# EasyEDA Pro project 十二届 蓝桥杯EDA 国赛真题.epro

# Schematic SCH
Board Name: Board1; Create Date: 2024-11-06; Page Name: SCH; Project Name: 十二届 蓝桥杯EDA 国赛真题; Schematic Name: SCH; Update Date: 2024-11-06; Company: 嘉立创EDA; Page Size: A3; Version: V1.0
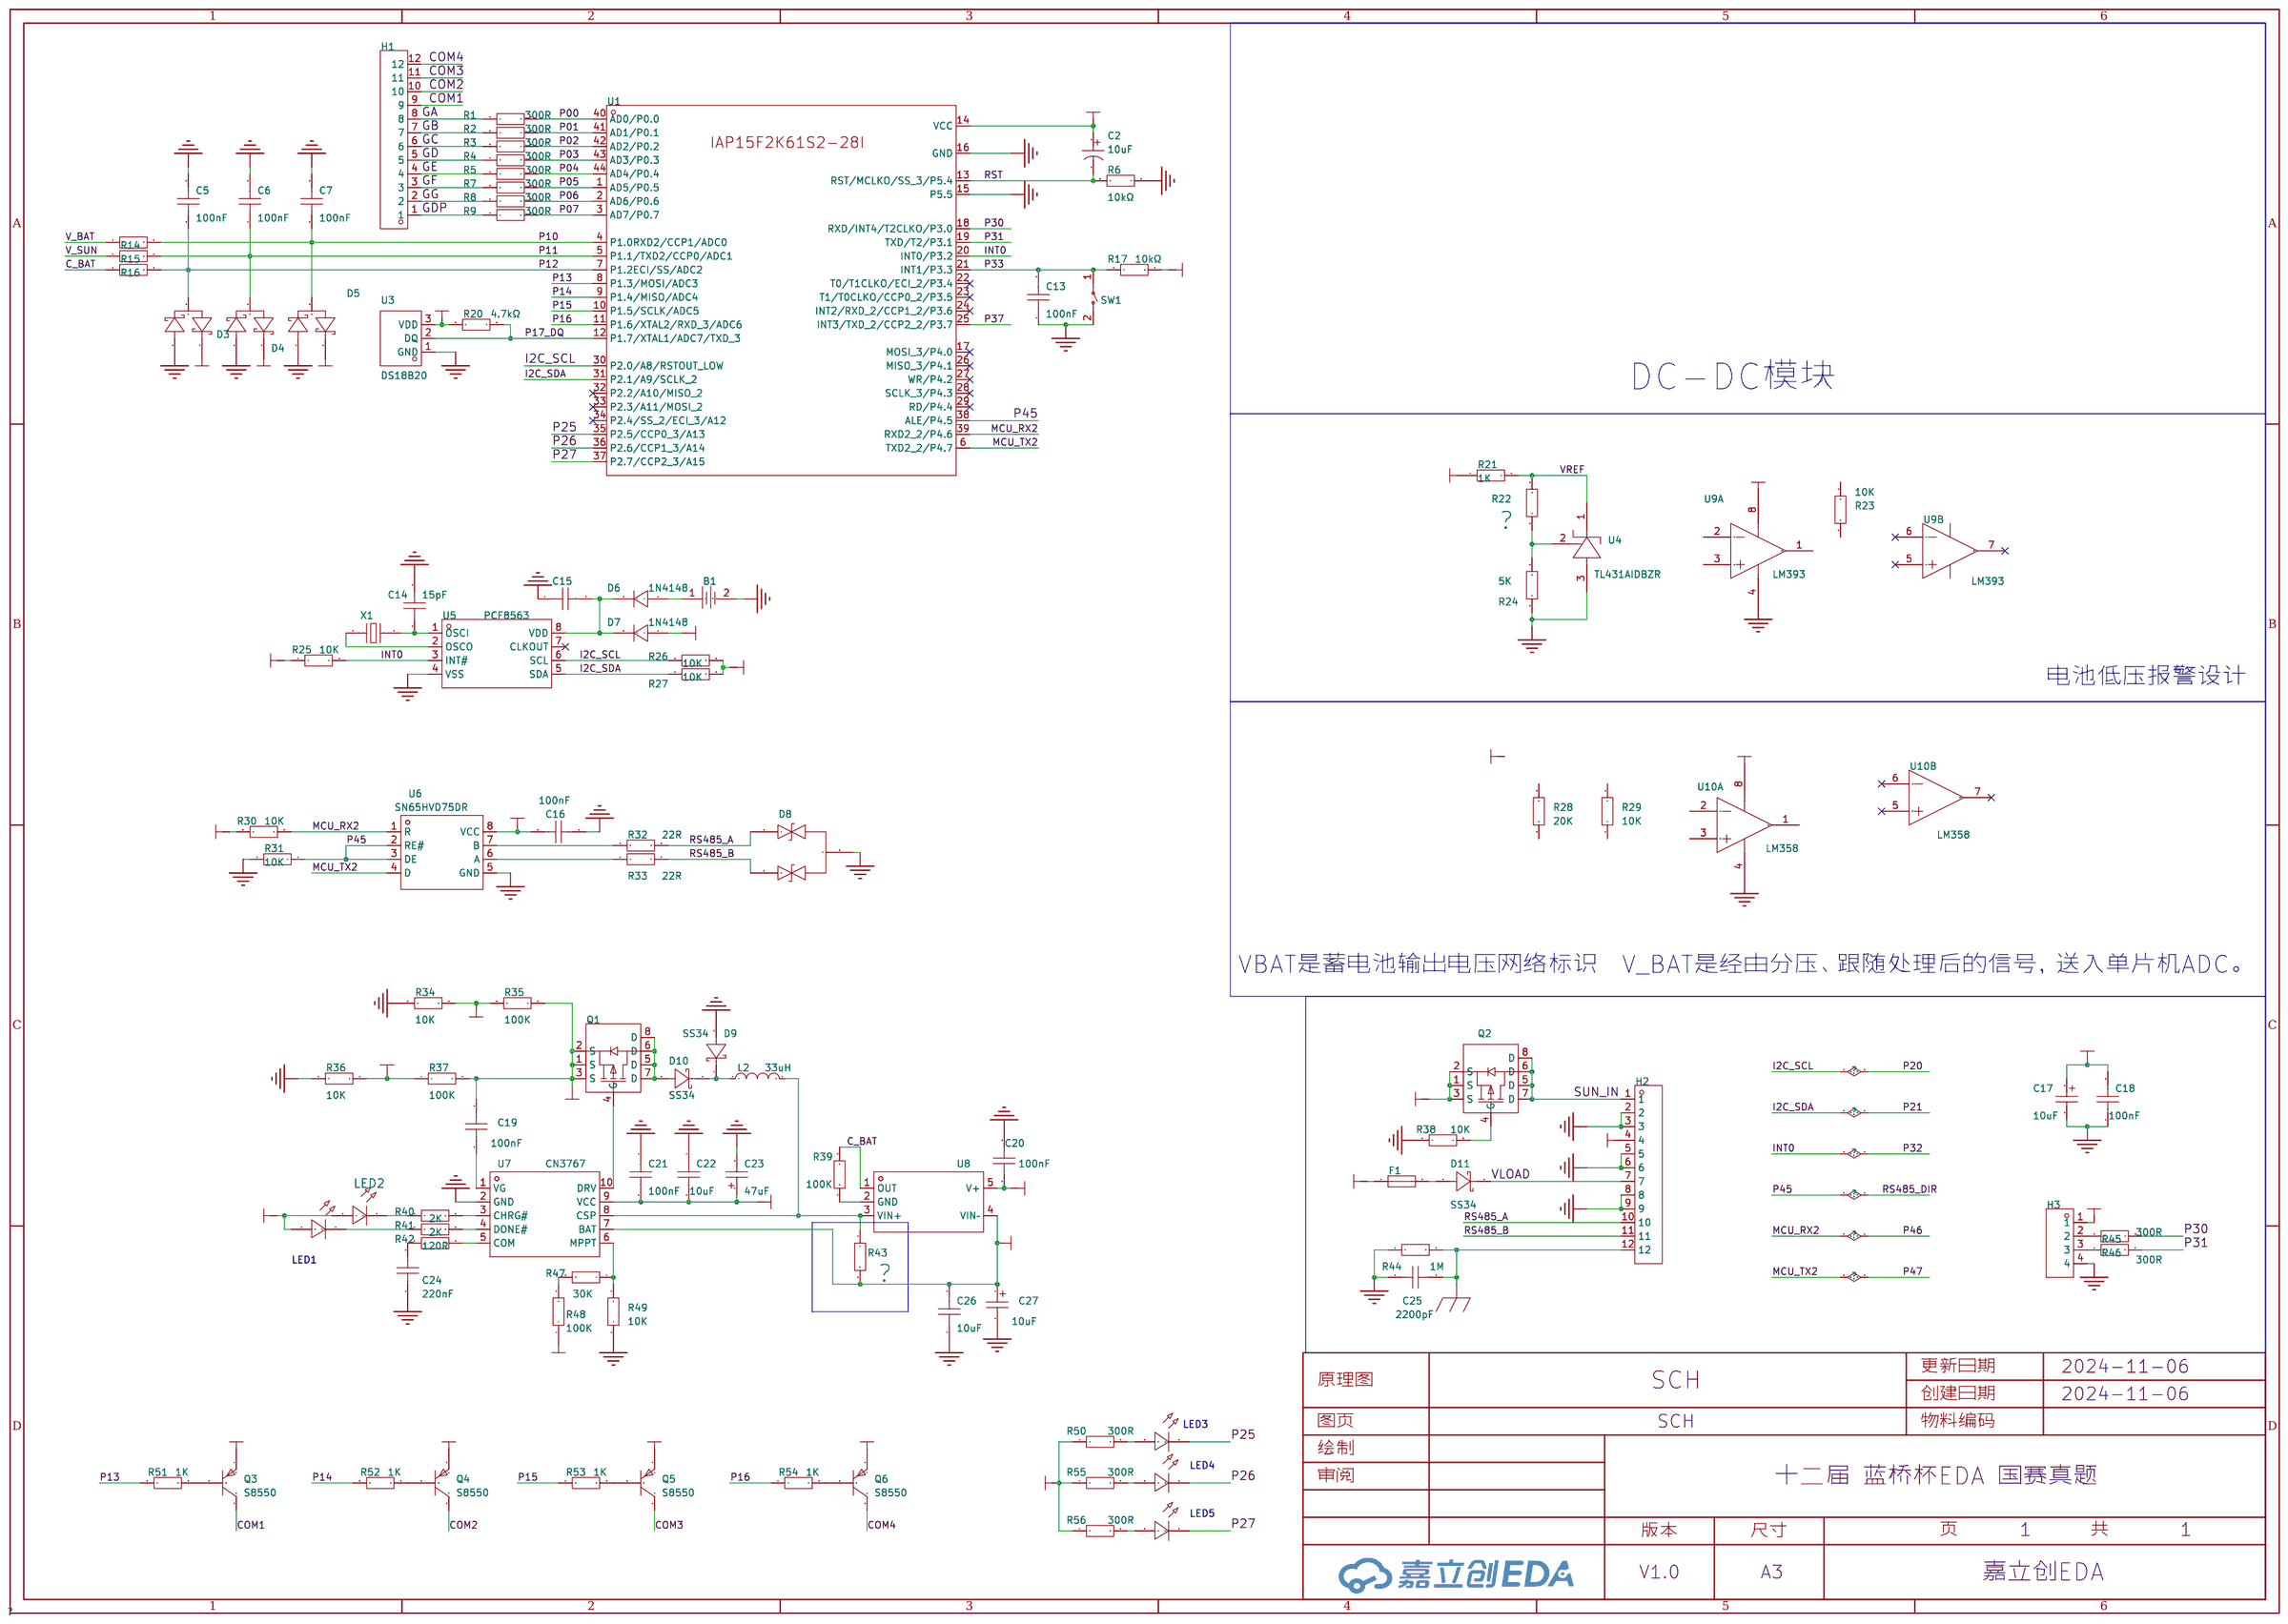
[diagram p0: schematic sheet]

## Parts
B1  CR2032-BS-6-1  [BAT-TH_CR2032-BS-6-1]
C2  10uF  [CAP-TH_BD10.0-P5.00-D1.0-FD]
C5  100nF  [C0805]
C6  100nF  [C0805]
C7  100nF  [C0805]
C13  100nF  [C0805]
C14  15pF  [C0603]
C15  100nF  [C0805]
C16  100nF  [C0805]
C17  10uF  [C_Ele_SMD_3x5.4mm]
C18  100nF  [C0805]
C19  100nF  [C0805]
C20  100nF  [C0805]
C21  100nF  [C0805]
C22  10uF  [C0805]
C23  47uF  [C_Ele_SMD_3x5.4mm]
C24  220nF  [C0805]
C25  2200pF  [C0805]
C26  10uF  [C0805]
C27  10uF  [C_Ele_SMD_3x5.4mm]
D3  BAT54S  [SOT-23-3_L2.9-W1.3-P1.90-LS2.4-BR]
D4  BAT54S  [SOT-23-3_L2.9-W1.3-P1.90-LS2.4-BR]
D5  BAT54S  [SOT-23-3_L2.9-W1.3-P1.90-LS2.4-BR]
D6  1N4148  [DO-35_BD2.0-L4.0-P8.00-D0.5-FD]
D7  1N4148  [DO-35_BD2.0-L4.0-P8.00-D0.5-FD]
D8  SM712  [SOT-23-3_L2.9-W1.3-P1.90-LS2.4-BR]
D9  SS34  [SMA_L4.3-W2.7-LS5.1-RD]
D10  SS34  [SMA_L4.3-W2.7-LS5.1-RD]
D11  SS34  [SMA_L4.3-W2.7-LS5.1-RD]
F1  BSMD1206-100-24V  [F1206]
H1  -  [HDR-TH_12P-P2.54-V-M]
H2  -  [HDR-TH_12P-P2.54-V-M]
H3  -  [hdr-th_4p-p2.54-v-f]
L2  33uH  [IND-SMD_L4.0-W4.0_HPC4018BM]
LED1  -  [LED_0603]
LED2  -  [LED_0603]
LED3  -  [LED_0603]
LED4  -  [LED_0603]
LED5  -  [LED_0603]
Q1  AO4459  [SOP-8_L5.0-W4.0-P1.27-LS6.2-BL]
Q2  AO4459  [SOP-8_L5.0-W4.0-P1.27-LS6.2-BL]
Q3  S8550  [TO-92-3_L4.5-W3.5-P1.27-L]
Q4  S8550  [TO-92-3_L4.5-W3.5-P1.27-L]
Q5  S8550  [TO-92-3_L4.5-W3.5-P1.27-L]
Q6  S8550  [TO-92-3_L4.5-W3.5-P1.27-L]
R1  300R  [R0603]
R2  300R  [R0603]
R3  300R  [R0603]
R4  300R  [R0603]
R5  300R  [R0603]
R6  10kΩ  [Res_1/2W]
R7  300R  [R0603]
R8  300R  [R0603]
R9  300R  [R0603]
R14  10K  [R0805]
R15  10K  [R0805]
R16  10K  [R0805]
R17  10kΩ  [Res_1/2W]
R20  4.7kΩ  [Res_1/2W]
R21  1K  [R0805]
R22  ?  [R0805]
R23  10K  [R0805]
R24  5K  [R0805]
R25  10K  [R0805]
R26  10K  [R0805]
R27  10K  [R0805]
R28  20K  [R0805]
R29  10K  [R0805]
R30  10K  [R0805]
R31  10K  [R0805]
R32  22R  [R0805]
R33  22R  [R0805]
R34  10K  [R0805]
R35  100K  [R0805]
R36  10K  [R0805]
R37  100K  [R0805]
R38  10K  [R0805]
R39  100K  [R0805]
R40  2K  [R0603]
R41  2K  [R0603]
R42  120R  [R0603]
R43  ？  [R0805]
R44  1M  [R1206]
R45  300R  [R0603]
R46  300R  [R0603]
R47  30K  [R0805]
R48  100K  [R0805]
R49  10K  [R0805]
R50  300R  [R0603]
R51  1K  [R0603]
R52  1K  [R0603]
R53  1K  [R0603]
R54  1K  [R0603]
R55  300R  [R0603]
R56  300R  [R0603]
SW1  K2-1107ST-A4SW-06  [SW-SMD_L6.1-W3.6-LS7.9]
U1  IAP15F2K61S2-28I-LQFP44  [LQFP-44_L10.0-W10.0-P0.80-LS12.0-BL]
U3  DS18B20  [TO-92-3_L4.9-W3.7-P1.27-L]
U4  TL431AIDBZR  [SOT-23-3_L2.9-W1.6-P1.90-LS2.8-BR]
U5  PCF8563  [SOP-8_L4.9-W3.9-P1.27-LS6.0-BL]
U6  SN65HVD75DR  [SOIC-8_L4.9-W3.9-P1.27-LS6.0-BL]
U7  CN3767  [SSOP-10_L4.9-W3.9-P1.00-LS6.0-BL]
U8  INA168NA/3K  [SOT-23-5_L3.0-W1.7-P0.95-LS2.8-BR]
U9  LM393  [SOP-8_L4.9-W3.9-P1.27-LS6.0-BL]  (sections 1,2)
U10  LM358  [SOP-8_L4.9-W3.9-P1.27-LS6.0-BL]  (sections 1,2)
X1  32.768kHz  [OSC-SMD_L3.2-W1.5]

## Library data of the parts
B1 = CR2032-BS-6-1: 连接器类型:电池底座;适用电池规格:CR2032;工作温度范围:-;; LCSC Part Name: 电池底座 适用电池:CR2032; Supplier Part: C70377; Manufacturer: Q&J; Supplier Footprint: SMD; Datasheet: https://atta.szlcsc.com/upload/public/pdf/source/20160427/1461725216549.pdf; Supplier: LCSC; Connector Type: 电池底座; Battery Type: CR2032
C2 = NP106V100G12RR0VH2FP0: 容值:10uF;精度:-10%~+20%;额定电压:100V;; LCSC Part Name: 10uF -10%~+20% 100V; Supplier Part: C56706; Manufacturer: CX(承兴); Supplier Footprint: 插件,D10xL12mm; JLCPCB Part Class: 扩展库; Supplier: LCSC; Tolerance: -10%~+20%; Rated Voltage: 100V; Lead Spacing: 5mm; φD: 10mm; L: 12mm; Lifetime @ Temp: 1000hrs@105℃; Operating Temperature: -40℃~+105℃
C5-C7 C13 C15 C16 C18-C22 C24-C26 = CAP_0805: Supplier Footprint: 0805
C14 = CAP_0603: Supplier Footprint: 0603
C17 C23 C27 = C_Ele_SMD_3x5.4mm: Supplier Footprint: SMD,3x5.4mm
D3-D5 = BAT54S_C916425: 二极管配置:1对串联式;正向压降(Vf):800mV@100mA;直流反向耐压(Vr):30V;平均整流电流(Io):200mA;; LCSC Part Name: 电压:30V 电流:200mA; Supplier Part: C916425; Manufacturer: JSMSEMI(杰盛微); Supplier Footprint: SOT-23; JLCPCB Part Class: 扩展库; Datasheet: https://atta.szlcsc.com/upload/public/pdf/source/20230807/4DC032BFF2527F74FFA5A2420773D8A6.pdf; Supplier: LCSC; Diode Configuration: 1对串联式; Forward Voltage (Vf@If): 800mV@100mA; Reverse Voltage (Vr): 30V; Average Rectified Current (Io): 200mA; Reverse Leakage Current (Ir): 2uA@25V
D6 D7 = 1N4148_C258182: 二极管配置:-;正向压降(Vf):1V@10mA;直流反向耐压(Vr):100V;平均整流电流(Io):200mA;反向恢复时间(trr):4ns;; LCSC Part Name: 电压:100V 电流:200mA; Supplier Part: C258182; Manufacturer: onsemi(安森美); Supplier Footprint: DO-35; JLCPCB Part Class: 扩展库; Datasheet: https://atta.szlcsc.com/upload/public/pdf/source/20180829/C258182_3EE2D0AB6109C1B72B054FC50B8BC8AD.pdf; Supplier: LCSC; Forward Voltage (Vf@If): 1V@10mA; Reverse Voltage (Vr): 100V; Average Rectified Current (Io): 200mA; Reverse Leakage Current: 5uA@75V; Reverse Recovery Time (trr): 4ns; Operating Temperature: -55℃~+175℃@(Tj)
D8 = SM712_C521963: 极性:双向;反向截止电压(Vrwm):12V；7V;最大钳位电压:15V；25V;峰值脉冲电流(Ipp):7A;峰值脉冲功率(Ppp):150W;击穿电压:7.5V；13.3V;; Supplier Part: C521963; Manufacturer: TECH PUBLIC(台舟); Supplier Footprint: SOT-23; Datasheet: https://atta.szlcsc.com/upload/public/pdf/source/20210810/E76C7C1824B0CB2A5B8963B3ABCE2DCE.pdf; Supplier: LCSC; polarity: 双向; Reverse Stand-Off Voltage (Vrwm): 12V；7V; Maximum Clamping Voltage: 15V；25V; Peak Pulse Current (Ipp): 7A; Peak Pulse Power Dissipation (Ppp): 150W; Breakdown Voltage: 7.5V；13.3V; Reverse Leakage Current (Ir): 500nA；10nA; Number of Lines: 双路; Operating Temperature: -55℃~+125℃; level of protection: IEC 61000-4-2; Type: ESD
D9-D11 = SS34_C908680: 二极管配置:独立式;正向压降(Vf):550mV@3A;直流反向耐压(Vr):40V;平均整流电流(Io):3A;; LCSC Part Name: 电压:40V 电流:3A; Supplier Part: C908680; Manufacturer: GOODWORK(固得沃克); Supplier Footprint: SMA(DO-214AC); JLCPCB Part Class: Extended Part; Datasheet: https://atta.szlcsc.com/upload/public/pdf/source/20201231/C908680_3AF1E918602332DB656247DB47FBC636.pdf; Supplier: LCSC; Diode Configuration: 独立式; Forward Voltage (Vf@If): 550mV@3A; Reverse Voltage (Vr): 40V; Average Rectified Current (Io): 3A; Reverse Leakage Current (Ir): 200uA@40V
F1 = BSMD1206-100-24V: 最大电压:24V;最大电流:40A;保持电流:1A;跳闸电流:1.8A;; LCSC Part Name: 1206 1A 24V 佰宏高电压; Supplier Part: C910830; Manufacturer: BHFUSE(佰宏); Supplier Footprint: 1206; JLCPCB Part Class: 扩展库; Datasheet: https://atta.szlcsc.com/upload/public/pdf/source/20230512/E419278EC8529AAF514173EF221BCF4B.pdf; Supplier: LCSC; Operating Voltage (Max): 24V; Current Rating (Max): 40A; Hold Current: 1A; Trip Current: 1.8A; Power Dissipation: 1W; Resistance - Initial (Ri) (Min): 50mΩ; Resistance - Post Trip (R1) (Max): 270mΩ; Maximum Time to Trip: 300ms; Operating Temperature: -40℃~+85℃
H1 H2 = HDR-M_2.54_1x12P: 间距:2.54mm;总PIN位数:12;排数:1;插针结构:1x12P;行距:-;安装类型:直插;圆针/方针:方针;额定电流:3A;额定电压:250V;配合针长度:6mm;塑高:2.5mm;端接针长度:3mm;触头材质:-;工作温度范围:-40℃~+105℃;颜色:黑色;; Supplier Part: C2840012; Supplier Footprint: 插件
H3 = HDR-F_2.54_1x4P: Supplier Part: C2718488; Supplier Footprint: 插件
L2 = APSWPA4030S330MTF: 电感值:33uH;精度:±20%;额定电流:840mA;饱和电流(Isat):1.1A;类型:磁胶屏蔽绕线电感;; LCSC Part Name: 33uH ±20% 1.1A; Supplier Part: C5363799; Manufacturer: APV(爱普微); Supplier Footprint: SMD,4x4mm; JLCPCB Part Class: Extended Part; Datasheet: https://atta.szlcsc.com/upload/public/pdf/source/20230530/A928E36C9C0D5568E2FD40B807FF4643.pdf; Supplier: LCSC; Tolerance: ±20%; Rated Current: 840mA; Saturation Current (Isat): 1.1A; DC Resistance (DCR): 429mΩ; Type: 磁胶屏蔽绕线电感
LED1 = LED_0603-G: Supplier Footprint: 0603
LED2 = LED_0603-R: Supplier Footprint: 0603
LED3-LED5 = LED_0603-B: Supplier Footprint: 0603
Q1 Q2 = AO4459: 类型:1个P沟道;漏源电压(Vdss):30V;连续漏极电流(Id):6.5A;功率(Pd):3.1W;导通电阻(RDS(on)@Vgs,Id):46mΩ@10V,6.5A;阈值电压(Vgs(th)@Id):2.5V@250uA;; LCSC Part Name: 1个P沟道 耐压:30V 电流:6.5A; Supplier Part: C49047; Manufacturer: AOS; Supplier Footprint: SOP-8; JLCPCB Part Class: 扩展库; Datasheet: https://atta.szlcsc.com/upload/public/pdf/source/20150601/1457707316877.pdf; Supplier: LCSC; Type: 1个P沟道; Drain Source Voltage (Vdss): 30V; Continuous Drain Current (Id): 6.5A; Power Dissipation (Pd): 3.1W; Drain Source On Resistance (RDS(on)@Vgs,Id): 46mΩ@10V,6.5A; Gate Threshold Voltage (Vgs(th)@Id): 2.5V@250uA; Total Gate Charge (Qg@Vgs): 16nC@10V; Input Capacitance (Ciss@Vds): 830pF@15V; Operating Temperature: -55℃~+150℃@(Tj)
Q3-Q6 = S8550_C2931493: 晶体管类型:PNP;集电极电流(Ic):500mA;集射极击穿电压(Vceo):25V;功率(Pd):625mW;直流电流增益(hFE@Ic,Vce):160@50mA,1V;; LCSC Part Name: PNP 电流:500mA 耐压:25V; Supplier Part: C2931493; Manufacturer: JSMSEMI(杰盛微); Supplier Footprint: TO-92-3; JLCPCB Part Class: 扩展库; Datasheet: https://atta.szlcsc.com/upload/public/pdf/source/20240105/F52EC9AE03FE5F64272EDBFE24453978.pdf; Supplier: LCSC; Transistor Type: PNP; Collector Current (Ic): 500mA; Collector-Emitter Breakdown Voltage (Vceo): 25V; Power Dissipation (Pd): 625mW; DC Current Gain (hFE@Ic,Vce): 160@50mA,1V; Transition Frequency (fT): 150MHz; Collector Cut-Off Current (Icbo): 100nA; Collector-Emitter Saturation Voltage (VCE(sat)@Ic,Ib): 600mV@500mA,50mA
R1-R5 R7-R9 R40-R42 R45 R46 R50-R56 = Res_0603: Supplier Footprint: 0603
R6 R17 R20 = Res_AXIAL-1/2W: Supplier Footprint: 轴向引线
R14-R16 R21-R39 R43 R47-R49 = Res_0805: Supplier Footprint: 0805
R44 = Res_1206: Supplier Footprint: 1206
SW1 = K2-1107ST-A4SW-06: 作用力:2.5N;安装方式:立贴;开关长度:6mm;开关宽度:3.6mm;开关高度:2.5mm;触点电流:50mA;额定电压(DC):12V;绝缘电阻:100MΩ;机械寿命:10万次;; Supplier Part: C2837195; Manufacturer: 韩国韩荣; Supplier Footprint: SMD; JLCPCB Part Class: 扩展库; Datasheet: https://atta.szlcsc.com/upload/public/pdf/source/20210810/381712CEF248770C072B585C3485C888.pdf; Supplier: LCSC; Operating Force: 2.5N; Mounting Style: 立贴; Switch Length: 6mm; Switch Width: 3.6mm; Switch Height: 2.5mm; Contact Current: 50mA; Voltage Rating (DC): 12V; Insulation Resistance: 100MΩ; Mechanical Life: 10万次; Operating Temperature: -25℃~+85℃
U1 = IAP15F2K61S2-28I-LQFP44: CPU内核:51系列;程序存储容量:61KB;RAM总容量:2KB;GPIO端口数量:42;工作电压范围:4.5V~5.5V;CPU最大主频:28MHz;程序存储器类型:FLASH;; Supplier Part: C47451; Manufacturer: STC(宏晶); Supplier Footprint: LQFP-44(10x10); JLCPCB Part Class: 扩展库; Datasheet: https://atta.szlcsc.com/upload/public/pdf/source/20200306/C50712_CB7A0FE99BDE9A8F947079BEF15207A3.pdf; Supplier: LCSC; CPU Core: 51系列; Program Storage Size: 61KB; RAM Size: 2KB; GPIO Ports Number: 42; Operating Voltage Range: 4.5V~5.5V; CPU Maximum Speed: 28MHz; Program Memory Type: FLASH; Operating Temperature Range: -40℃~+85℃; ADC (Bit): 10bit; 16Bit Timer: 3; UART/USART: 2; SPI: 1; Peripheral/Function: 低电压检测；看门狗；CCP捕获/比较; Watchdog: 有; Low-Voltage Detect: 有; CCP Capture/Compare: 有; Internal Oscillator: 有
U3 = DS18B20: 温度范围:-55℃~+125℃;精度:±0.4℃;接口类型:-;; Supplier Part: C376006; Manufacturer: UMW(友台半导体); Supplier Footprint: TO-92; JLCPCB Part Class: Extended Part; Datasheet: https://atta.szlcsc.com/upload/public/pdf/source/20231109/DC3DA9D47D486EF40A6E0F08B9A498E3.pdf; Supplier: LCSC; Temperature range: -55℃~+125℃; Resolution: ±0.4℃; Supply Voltage: 3V~5.5V
U4 = TL431AIDBZR: 输出类型:可调;输入电压:-;输出电压:2.495V~36V;输出电流:100mA;精度:±1%;; Supplier Part: C23892; Manufacturer: TI(德州仪器); Supplier Footprint: SOT-23; JLCPCB Part Class: 扩展库; Datasheet: https://www.ti.com/cn/lit/gpn/tl431; Supplier: LCSC; Output Type: 可调; Output Voltage: 2.495V~36V; Output Current: 100mA; Tolerance: ±1%; Reference Type: 并联; Minimum Cathode Current for Regulation: 700uA; Operating Temperature: -40℃~+85℃@(Ta)
U5 = PCF8563: 接口:-;晶振:-;闹钟输出:-;; Supplier Part: C5795601; Manufacturer: IDCHIP(英锐芯); Supplier Footprint: SOP-8; Datasheet: https://atta.szlcsc.com/upload/public/pdf/source/20230921/9DB04F89E1E4336DD7CCB7C268B77442.pdf; Supplier: LCSC; Operating Voltage: 1.8V~5.5V; Operating Temperature: -20℃~+85℃
U6 = SN65HVD75DR: 类型:收发器;数据速率:20Mbps;驱动器/接收器:1/1;; LCSC Part Name: 3.3V供电 20Mbps 收发器; Supplier Part: C57928; Manufacturer: TI(德州仪器); Supplier Footprint: SOIC-8; JLCPCB Part Class: 扩展库; Datasheet: https://www.ti.com/cn/lit/gpn/sn65hvd75; Supplier: LCSC; Types: 收发器; Supply Voltage: 3V~3.6V; Data Rate: 20Mbps; Driver/receiver: 1/1; Operating Temperature: -40℃~+125℃
U7 = CN3767: 具有太阳能电池大功率点跟踪功能的4A，12V 铅酸电池充电管理集成电路; Supplier Part: C81968; Manufacturer: CONSONANCE(上海如韵); Supplier Footprint: SSOP-10-150mil; JLCPCB Part Class: 扩展库; Datasheet: https://atta.szlcsc.com/upload/public/pdf/source/20170908/C81968_1504870117236958069.pdf; Supplier: LCSC
U8 = INA168NA/3K: INA168 60V、高侧、电流输出电流分流监控器; Supplier Part: C134294; Manufacturer: TI(德州仪器); Supplier Footprint: SOT-23-5; JLCPCB Part Class: 扩展库; Datasheet: https://www.ti.com/cn/lit/gpn/ina168; Supplier: LCSC; Supply Voltage: 2.7V~60V; Operating Temperature: -40℃~+125℃
U9 = LM393_C400839: 输入失调电压(Vos):3mV;输入偏置电流(Ib):-;轨到轨:-;; Supplier Part: C400839; Manufacturer: IDCHIP(英锐芯); Supplier Footprint: SOP-8; JLCPCB Part Class: 扩展库; Datasheet: https://atta.szlcsc.com/upload/public/pdf/source/20240308/5ED8EE163AE67417F731F81F7E9D3786.pdf; Supplier: LCSC; Input Offset Voltage (Vos): 3mV; Supply Voltage: 24V; Supply Current: 2.5mA
U10 = LM358_C5252902: 放大器数:双路;增益带宽积(GBP):1.2MHz;输入偏置电流(Ib):50nA;输入失调电压(Vos):5mV;; LCSC Part Name: 增益带宽(GBP):1.2MHz VIO:5mV  LM358; Supplier Part: C5252902; Manufacturer: MSKSEMI(美森科); Supplier Footprint: SOP-8; JLCPCB Part Class: 扩展库; Datasheet: https://atta.szlcsc.com/upload/public/pdf/source/20221111/EFA130B3B4599AE68A453AC9B85C4BC9.pdf; Supplier: LCSC; Number of Circuits: 双路; Gain Bandwidth Product(GBP): 1.2MHz; Current - Input Bias(Ib): 50nA; Voltage - Input Offset(Vos): 5mV; Common Mode Rejection Ratio (CMRR): 80dB; Supply Voltage: 3V~36V; Output Type: 差分; Supply Current: 300uA; Operating Temperature: 0℃~+70℃
X1 = X321532768KGD2SI: 晶振类型:贴片晶振;频率:32.768kHz;常温频差:±20ppm;外接负载电容:12.5pF;频率稳定度(全温):-;; LCSC Part Name: 32.768kHz ±20ppm 12.5pF; Supplier Part: C620155; Manufacturer: YXC(扬兴晶振); Supplier Footprint: SMD3215-2P; JLCPCB Part Class: 扩展库; Datasheet: https://atta.szlcsc.com/upload/public/pdf/source/20240329/3A7650FD985DD0DE85694D3785AB4916.pdf; Supplier: LCSC; Crystal Type: 贴片晶振; Normal temperature Frequency Tolerance: ±20ppm; External load capacitor: 12.5pF; Operating Temperature: -40℃~+85℃

## Nets
GND: B1.2 C5.2 C6.2 C7.2 C13.1 C14.2 C15.1 C16.2 C17.2 C18.1 C20.2 C21.1 C22.1 C23.2 C24.1 C25.1 C26.1 C27.2 D3.1(A) D4.1(A) D5.1(A) D8.3 D9.2(A) H2.2 H2.3 H2.5 H2.6 H2.8 H2.9 H3.4 R6.1 R24.1 R31.2 R34.2 R36.1 R38.1 R44.1 R49.1 SW1.2 U1.15(P5.5) U1.16(GND) U3.1(GND) U4.3(ANODE) U5.4(VSS) U6.5(GND) U7.2(GND) U9.4(GND) U10.4(VEE)
VBAT: C26.2 C27.1 F1.1 H2.4 R21.1 R43.2 U7.7(BAT) U8.4(VIN–) U10.8(VCC)
VDD: C2.1 C16.1 C17.1 C18.2 C20.1 D3.2(K) D4.2(K) D5.2(K) D7.1(A) H3.1 Q3.1(E) Q4.1(E) Q5.1(E) Q6.1(E) R17.2 R20.2 R25.1 R26.2 R27.2 R30.2 R50.1 R55.1 R56.1 U1.14(VCC) U3.3(VDD) U6.8(VCC) U8.5(V+) U9.8(VCC)
VIN: C19.2 C21.2 C22.2 C23.1 LED1.2(A) LED2.2(A) Q1.1(S) Q1.2(S) Q1.3(S) Q2.1(S) Q2.2(S) Q2.3(S) R35.1 R37.2 R48.1 U7.9(VCC)
C_BAT: R16.1 R39.2 U8.1(OUT)
COM1: H1.9 Q3.3(C)
COM2: H1.10 Q4.3(C)
COM3: H1.11 Q5.3(C)
COM4: H1.12 Q6.3(C)
GA: H1.8 R1.1
GB: H1.7 R2.1
GC: H1.6 R3.1
GD: H1.5 R4.1
GDP: H1.1 R9.1
GE: H1.4 R5.1
GF: H1.3 R7.1
GG: H1.2 R8.1
I2C_SCL: R26.1 U1.30(P2.0/A8/RSTOUT_LOW) U5.6(SCL)
I2C_SDA: R27.1 U1.31(P2.1/A9/SCLK_2) U5.5(SDA)
INT0: R25.2 U1.20(INT0/P3.2) U5.3(INT#)
MCU_RX2: R30.1 U1.39(RXD2_2/P4.6) U6.1(R)
MCU_TX2: U1.6(TXD2_2/P4.7) U6.4(D)
P00: R1.2 U1.40(AD0/P0.0)
P01: R2.2 U1.41(AD1/P0.1)
P02: R3.2 U1.42(AD2/P0.2)
P03: R4.2 U1.43(AD3/P0.3)
P04: R5.2 U1.44(AD4/P0.4)
P05: R7.2 U1.1(AD5/P0.5)
P06: R8.2 U1.2(AD6/P0.6)
P07: R9.2 U1.3(AD7/P0.7)
P10: C7.1 D5.3 R14.2 U1.4(P1.0RXD2/CCP1/ADC0)
P11: C6.1 D4.3 R15.2 U1.5(P1.1/TXD2/CCP0/ADC1)
P12: C5.1 D3.3 R16.2 U1.7(P1.2ECI/SS/ADC2)
P13: R51.1 U1.8(P1.3/MOSI/ADC3)
P14: R52.1 U1.9(P1.4/MISO/ADC4)
P15: R53.1 U1.10(P1.5/SCLK/ADC5)
P16: R54.1 U1.11(P1.6/XTAL2/RXD_3/ADC6)
P17_DQ: R20.1 U1.12(P1.7/XTAL1/ADC7/TXD_3) U3.2(DQ)
P25: LED3.1(C) U1.35(P2.5/CCP0_3/A13)
P26: LED4.1(C) U1.36(P2.6/CCP1_3/A14)
P27: LED5.1(C) U1.37(P2.7/CCP2_3/A15)
P30: R45.2 U1.18(RXD/INT4/T2CLKO/P3.0)
P31: R46.2 U1.19(TXD/T2/P3.1)
P33: C13.2 R17.1 SW1.1 U1.21(INT1/P3.3)
P37: U1.25(INT3/TXD_2/CCP2_2/P3.7)
P45: R31.1 U1.38(ALE/P4.5) U6.2(RE#) U6.3(DE)
PE: C25.2 H2.12 R44.2
RS485_A: D8.1 H2.10 R32.2
RS485_B: D8.2 H2.11 R33.2
RST: C2.2 R6.2 U1.13(RST/MCLKO/SS_3/P5.4)
SUN_IN: H2.1 Q2.5(D) Q2.6(D) Q2.7(D) Q2.8(D)
V_BAT: R14.1
V_SUN: R15.1 R34.1 R35.2 R36.2 R37.1
VLOAD: D11.1(C) H2.7
VREF: R21.2 R22.2 U4.1(CATHODE)
Net-(B1-1): B1.1 D6.1(A)
Net-(C14-1): C14.1 U5.1(OSCI) X1.2
Net-(C15-2): C15.2 D6.2(K) D7.2(K) U5.8(VDD)
Net-(C19-1): C19.1 U7.1(VG)
Net-(C24-2): C24.2 R42.1
Net-(D9-1): D9.1(C) D10.1(C) L2.1
Net-(D10-2): D10.2(A) Q1.5(D) Q1.6(D) Q1.7(D) Q1.8(D)
Net-(D11-2): D11.2(A) F1.2
Net-(H3-2): H3.2 R45.1
Net-(H3-3): H3.3 R46.1
Net-(L2-2): L2.2 R43.1 U7.8(CSP) U8.3(VIN+)
Net-(LED1-1): LED1.1(C) R41.1
Net-(LED2-1): LED2.1(C) R40.1
Net-(LED3-2): LED3.2(A) R50.2
Net-(LED4-2): LED4.2(A) R55.2
Net-(LED5-2): LED5.2(A) R56.2
Net-(Q1-4): Q1.4(G) U7.10(DRV)
Net-(Q2-4): Q2.4(G) R38.2
Net-(Q3-2): Q3.2(B) R51.2
Net-(Q4-2): Q4.2(B) R52.2
Net-(Q5-2): Q5.2(B) R53.2
Net-(Q6-2): Q6.2(B) R54.2
Net-(R22-1): R22.1 R24.2 U4.2(REF)
Net-(R32-1): R32.1 U6.7(B)
Net-(R33-1): R33.1 U6.6(A)
Net-(R39-1): R39.1 U8.2(GND)
Net-(R40-2): R40.2 U7.3(CHRG#)
Net-(R41-2): R41.2 U7.4(DONE#)
Net-(R42-2): R42.2 U7.5(COM)
Net-(R47-1): R47.1 R49.2 U7.6(MPPT)
Net-(R47-2): R47.2 R48.2
Net-(U5-2): U5.2(OSCO) X1.1

Not connected (* = marked no-connect by the designer): R23 1 2; R28 1 2; R29 1 2; U1 17(MOSI_3/P4.0)* 22(T0/T1CLKO/ECI_2/P3.4)* 23(T1/T0CLKO/CCP0_2/P3.5)* 24(INT2/RXD_2/CCP1_2/P3.6)* 26(MISO_3/P4.1)* 27(WR/P4.2)* 28(SCLK_3/P4.3)* 29(RD/P4.4)* 32(P2.2/A10/MISO_2)* 33(P2.3/A11/MOSI_2)* 34(P2.4/SS_2/ECI_3/A12)*; U5 7(CLKOUT)*; U9 1(OUTA) 2(INA-) 3(INA+) 5(INB+)* 6(INB-)* 7(OUTB)*; U10 1(OUT1) 2(IN1-) 3(IN1+) 5(IN2+)* 6(IN2-)* 7(OUT2)*

## Notes on the sheet
- DC-DC模块
- 电池低压报警设计
- VBAT是蓄电池输出电压网络标识
- V_BAT是经由分压、跟随处理后的信号，送入单片机ADC。
